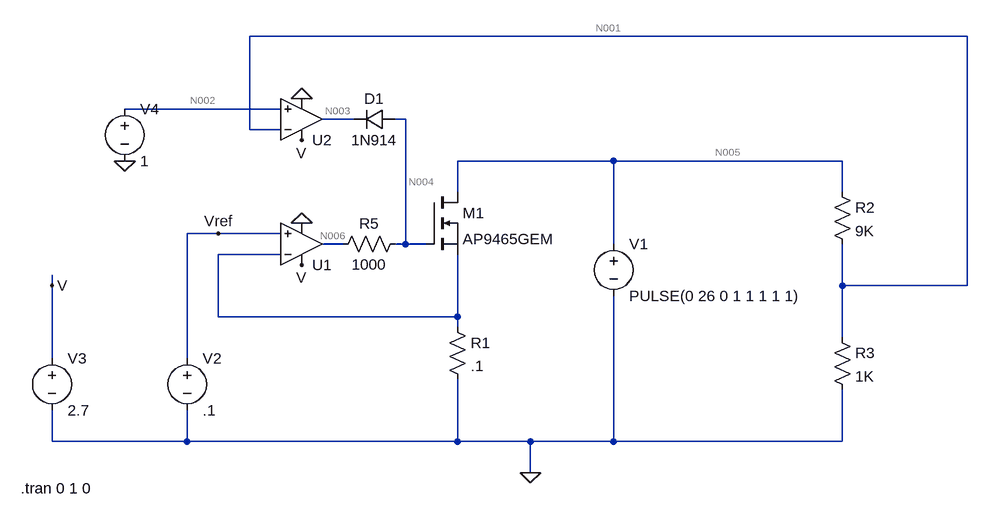
[diagram p0: schematic CurrentSink.asc]
CurrentSink.asc, the LTspice schematic file:
Version 4
SHEET 1 1252 680
WIRE 1024 -112 -80 -112
WIRE -32 0 -272 0
WIRE 80 16 32 16
WIRE 160 16 144 16
WIRE -80 32 -80 -112
WIRE -32 32 -80 32
WIRE 480 80 240 80
WIRE 832 80 480 80
WIRE 240 128 240 80
WIRE 832 128 832 80
WIRE -128 192 -176 192
WIRE -32 192 -128 192
WIRE 64 208 32 208
WIRE 160 208 160 16
WIRE 160 208 144 208
WIRE 192 208 160 208
WIRE 480 208 480 80
WIRE -32 224 -128 224
WIRE -384 272 -384 256
WIRE 832 272 832 208
WIRE 1024 272 1024 -112
WIRE 1024 272 832 272
WIRE -128 320 -128 224
WIRE 240 320 240 224
WIRE 240 320 -128 320
WIRE 240 336 240 320
WIRE 832 352 832 272
WIRE -384 384 -384 272
WIRE -176 384 -176 192
WIRE -384 512 -384 464
WIRE -176 512 -176 464
WIRE -176 512 -384 512
WIRE 240 512 240 416
WIRE 240 512 -176 512
WIRE 352 512 240 512
WIRE 480 512 480 288
WIRE 480 512 352 512
WIRE 832 512 832 432
WIRE 832 512 480 512
WIRE 352 560 352 512
FLAG 352 560 0
FLAG 0 176 0
FLAG -384 272 V
FLAG 0 240 V
FLAG -128 192 Vref
FLAG 0 -16 0
FLAG 0 48 V
FLAG -272 80 0
DATAFLAG -400 272 ""
SYMBOL Opamps\\UniversalOpamp2 0 208 M180
SYMATTR InstName U1
SYMBOL res 224 320 R0
SYMATTR InstName R1
SYMATTR Value .1
SYMBOL voltage 480 192 R0
WINDOW 123 0 0 Left 2
WINDOW 39 0 0 Left 2
SYMATTR InstName V1
SYMATTR Value PULSE(0 26 0 1 1 1 1 1)
SYMBOL voltage -176 368 R0
WINDOW 123 0 0 Left 2
WINDOW 39 0 0 Left 2
SYMATTR InstName V2
SYMATTR Value .1
SYMBOL voltage -384 368 R0
WINDOW 123 0 0 Left 2
WINDOW 39 0 0 Left 2
SYMATTR InstName V3
SYMATTR Value 2.7
SYMBOL nmos 192 128 R0
SYMATTR InstName M1
SYMATTR Value AP9465GEM
SYMBOL res 160 192 R90
WINDOW 0 0 56 VBottom 2
WINDOW 3 32 56 VTop 2
SYMATTR InstName R5
SYMATTR Value 1000
SYMBOL Opamps\\UniversalOpamp2 0 16 M180
SYMATTR InstName U2
SYMBOL res 816 112 R0
SYMATTR InstName R2
SYMATTR Value 9K
SYMBOL res 816 336 R0
SYMATTR InstName R3
SYMATTR Value 1K
SYMBOL diode 144 0 R90
WINDOW 0 0 32 VBottom 2
WINDOW 3 32 32 VTop 2
SYMATTR InstName D1
SYMATTR Value 1N914
SYMBOL voltage -272 -16 R0
WINDOW 123 0 0 Left 2
WINDOW 39 0 0 Left 2
SYMATTR InstName V4
SYMATTR Value 1
TEXT -432 584 Left 2 !.tran 0 1 0

The netlist it stands for:
* CurrentSink.asc
XU1 Vref N007 V 0 N006 level.2 Avol=1Meg GBW=10Meg Slew=10Meg ilimit=25m rail=0 Vos=0 phimargin=45 en=0 enk=0 in=0 ink=0 Rin=500Meg  ; pins IN+ IN- V+ V- OUT
R1 N007 0 .1
V1 N005 0 PULSE(0 26 0 1 1 1 1 1)
V2 Vref 0 .1
V3 V 0 2.7
M1 N005 N004 N007 N007 AP9465GEM
R5 N004 N006 1000
XU2 N002 N001 V 0 N003 level.2 Avol=1Meg GBW=10Meg Slew=10Meg ilimit=25m rail=0 Vos=0 phimargin=45 en=0 enk=0 in=0 ink=0 Rin=500Meg  ; pins IN+ IN- V+ V- OUT
R2 N005 N001 9K
R3 N001 0 1K
D1 N004 N003 1N914
V4 N002 0 1
.model D D
.lib standard.dio
.model NMOS NMOS
.model PMOS PMOS
.lib standard.mos
.tran 0 1 0
.lib UniversalOpamps2.sub
.backanno
.end

* Results of the author's LTspice run, read from the files saved beside the schematic
* Operating Point, zero values left out:
*   V(n006) = 2.7 V
*   V(v) = 2.7 V
*   V(vref) = 100 mV
*   V(n004) = 2.7 V
*   V(n003) = 2.7 V
*   V(n001) = 2.43 µV
*   V(n002) = 1 V
*   Id(M1) = -1.764 nA
*   Is(M1) = 1.764 nA
*   I(R3) = 2.43 nA
*   I(R2) = -270 pA
*   I(R1) = 935.7 pA
*   I(V4) = 700 pA
*   I(V3) = -581.8 nA
*   I(V2) = 2.5 nA
*   I(V1) = 2.034 nA
*   Ix(u1:1) = -2.5 nA
*   Ix(u1:2) = -2.7 nA
*   Ix(u1:3) = 307.6 nA
*   Ix(u1:4) = -343.7 nA
*   Ix(u2:1) = -700 pA
*   Ix(u2:2) = -2.7 nA
*   Ix(u2:3) = 274.2 nA
*   Ix(u2:4) = -334.3 nA
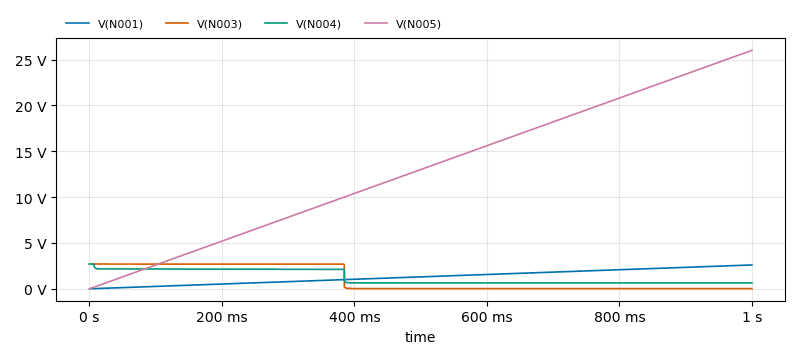
[diagram p1: Transient Analysis of CurrentSink.asc, plotted from the saved traces]
* Transient Analysis, 1 run:
*   V(N001): min 2.43 µV, max 2.6 V, average 1.3 V, rms 1.508 V, last 2.6 V
*   V(N003): min 22.27 mV, max 2.7 V, average 1.053 V, rms 1.675 V, last 22.28 mV
*   V(N004): min 639.8 mV, max 2.7 V, average 1.227 V, rms 1.434 V, last 639.8 mV
*   V(N005): min 0 V, max 26 V, average 13 V, rms 15.08 V, last 26 V